# EAGLE design Genesis (EAGLE 9.6.2)
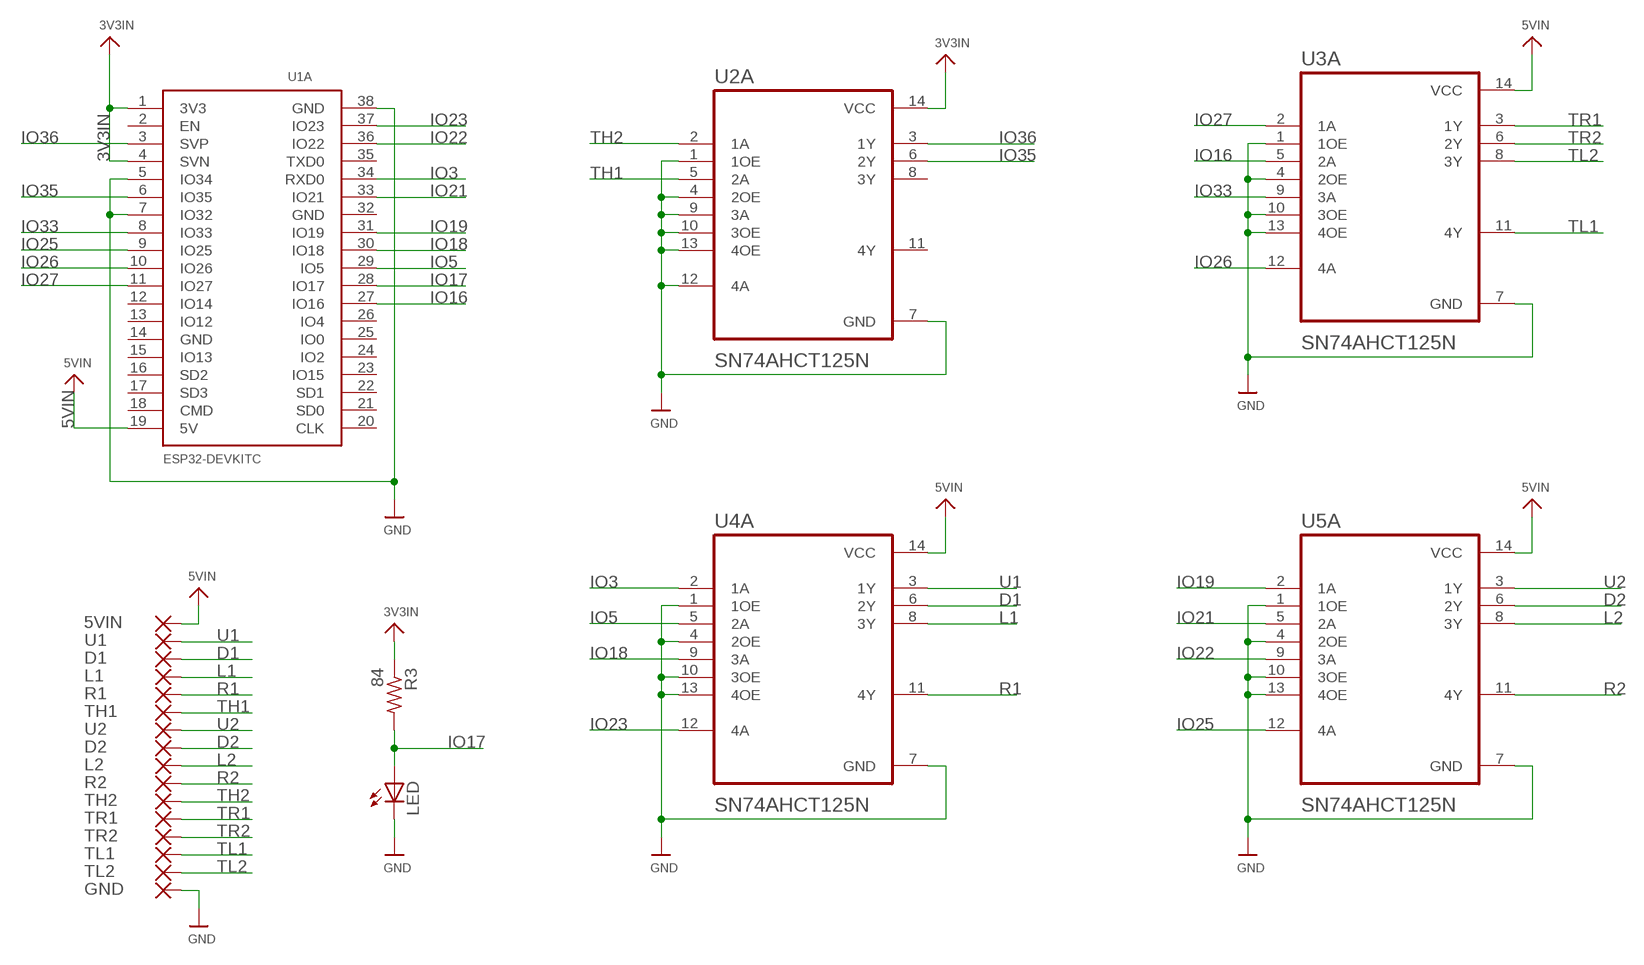
[diagram p0: schematic, sheet 1]

## Parts
5VIN  SMD5  [SMD2,54-5,08]
D1  SMD5  [SMD2,54-5,08]
D2  SMD5  [SMD2,54-5,08]
GND  SMD5  [SMD2,54-5,08]
L1  SMD5  [SMD2,54-5,08]
L2  SMD5  [SMD2,54-5,08]
LED  LEDCHIPLED_1206  [CHIPLED_1206]
R1  SMD5  [SMD2,54-5,08]
R2  SMD5  [SMD2,54-5,08]
R3  84  R-US_R1206  [R1206]
TH1  SMD5  [SMD2,54-5,08]
TH2  SMD5  [SMD2,54-5,08]
TL1  SMD5  [SMD2,54-5,08]
TL2  SMD5  [SMD2,54-5,08]
TR1  SMD5  [SMD2,54-5,08]
TR2  SMD5  [SMD2,54-5,08]
U1  SMD5  [SMD2,54-5,08]
U1A  ESP32DEVKITC  [ESP32-DEVKITC]
U2  SMD5  [SMD2,54-5,08]
U2A  SN74AHCT125N  [DIP794W45P254L1969H508Q14]
U3A  SN74AHCT125N  [DIP794W45P254L1969H508Q14]
U4A  SN74AHCT125N  [DIP794W45P254L1969H508Q14]
U5A  SN74AHCT125N  [DIP794W45P254L1969H508Q14]

## Nets
3V3IN: R3.1 U1A.1(3V3) U1A.4(SVN) U2A.14(VCC)
5VIN: 5VIN.1(P) U1A.19(5V) U3A.14(VCC) U4A.14(VCC) U5A.14(VCC)
D1: D1.1(P) U4A.6(2Y)
D2: D2.1(P) U5A.6(2Y)
GND: GND.1(P) LED.C U1A.5(IO34) U1A.7(IO32) U1A.38(GND) U2A.1(1OE) U2A.4(2OE) U2A.7(GND) U2A.9(3A) U2A.10(3OE) U2A.12(4A) U2A.13(4OE) U3A.1(1OE) U3A.4(2OE) U3A.7(GND) U3A.10(3OE) U3A.13(4OE) U4A.1(1OE) U4A.4(2OE) U4A.7(GND) U4A.10(3OE) U4A.13(4OE) U5A.1(1OE) U5A.4(2OE) U5A.7(GND) U5A.10(3OE) U5A.13(4OE)
IO3: U1A.34(RXD0) U4A.2(1A)
IO5: U1A.29(IO5) U4A.5(2A)
IO16: U1A.27(IO16) U3A.5(2A)
IO17: LED.A R3.2 U1A.28(IO17)
IO18: U1A.30(IO18) U4A.9(3A)
IO19: U1A.31(IO19) U5A.2(1A)
IO21: U1A.33(IO21) U5A.5(2A)
IO22: U1A.36(IO22) U5A.9(3A)
IO23: U1A.37(IO23) U4A.12(4A)
IO25: U1A.9(IO25) U5A.12(4A)
IO26: U1A.10(IO26) U3A.12(4A)
IO27: U1A.11(IO27) U3A.2(1A)
IO33: U1A.8(IO33) U3A.9(3A)
IO35: U1A.6(IO35) U2A.6(2Y)
IO36: U1A.3(SVP) U2A.3(1Y)
L1: L1.1(P) U4A.8(3Y)
L2: L2.1(P) U5A.8(3Y)
R1: R1.1(P) U4A.11(4Y)
R2: R2.1(P) U5A.11(4Y)
TH1: TH1.1(P) U2A.5(2A)
TH2: TH2.1(P) U2A.2(1A)
TL1: TL1.1(P) U3A.11(4Y)
TL2: TL2.1(P) U3A.8(3Y)
TR1: TR1.1(P) U3A.3(1Y)
TR2: TR2.1(P) U3A.6(2Y)
U1: U1.1(P) U4A.3(1Y)
U2: U2.1(P) U5A.3(1Y)
Unconnected: U1A.2(EN) U1A.12(IO14) U1A.13(IO12) U1A.14(GND) U1A.15(IO13) U1A.16(SD2) U1A.17(SD3) U1A.18(CMD) U1A.20(CLK) U1A.21(SD0) U1A.22(SD1) U1A.23(IO15) U1A.24(IO2) U1A.25(IO0) U1A.26(IO4) U1A.32(GND) U1A.35(TXD0) U2A.8(3Y) U2A.11(4Y)

## Library data of the parts
5VIN D1 D2 GND L1 L2 R1 R2 TH1 TH2 TL1 TL2 TR1 TR2 U1 U2 = wirepad:SMD5: SMD PAD
LED = adafruit:LED: LED OSRAM: - CHIPLED LG R971, LG N971, LY N971, LG Q971, LY Q971, LO R971, LY R971 LH N974, LH R974 LS Q976, LO Q976, LY Q976 LO Q996 - Hyper CHIPLED LW Q18S LB Q993, LB Q99A, LB R99A - SideLED LS A670, LO A670, LY A670, LG A670, LP A670 LB A673, LV A673, LT A673, LW A673 LH A674 LY A675 LS A676, LA A676, LO A676, LY A676, LW A676 LS A679, LY A679, LG A679 - Hyper Micro SIDELED® LS Y876, LA Y876, LO Y876, LY Y876 LT Y87S - SmartLED LW L88C, LW L88S LB L89C, LB L89S, LG L890 LS L89K, LO L89K, LY L89K LS L896, LA L896, LO L896, LY L896 - TOPLED LS T670, LO T670, LY T670, LG T670, LP T670 LSG T670, LSP T670, LSY T670, LOP T670, LYG T670 LG T671, LOG T671, LSG T671 LB T673, LV T673, LT T673, LW T673 LH T674 LS T676, LA T676, LO T676, LY T676, LB T676, LH T676, LSB T676, LW T676 LB T67C, LV T67C, LT T67C, LS T67K, LO T67K, LY T67K, LW E67C LS E67B, LA E67B, LO E67B, LY E67B, LB E67C, LV E67C, LT E67C LW T67C LS T679, LY T679, LG T679 LS T770, LO T770, LY T770, LG T770, LP T770 LB T773, LV T773, LT T773, LW T773 LH T774 LS E675, LA E675, LY E675, LS T675 LS T776, LA T776, LO T776, LY T776, LB T776 LHGB T686 LT T68C, LB T68C - Hyper Mini TOPLED® LB M676 - Mini TOPLED Santana® LG M470 LS M47K, LO M47K, LY M47K Source: http://www.osram.convergy.de/
R3 = adafruit:R-US_: RESISTOR, American symbol
U1A = ESP32-DEVKITC:ESP32DEVKITC
U2A U3A U4A U5A = SN74AHCT125N:SN74AHCT125N: None Check prices <https://pricing.snapeda.com/parts/SN74AHCT125N/Texas%20Instruments/view-part?ref=eda>; AVAILABILITY: In Stock; DESCRIPTION: Quadruple Bus Buffer Gates With 3-State Outputs 14-PDIP -40 to 125; MF: Texas Instruments; MP: SN74AHCT125N; PACKAGE: PDIP-14 Texas Instruments; PRICE: None; PURCHASE-URL: https://pricing.snapeda.com/search/part/SN74AHCT125N/?ref=eda

## Board
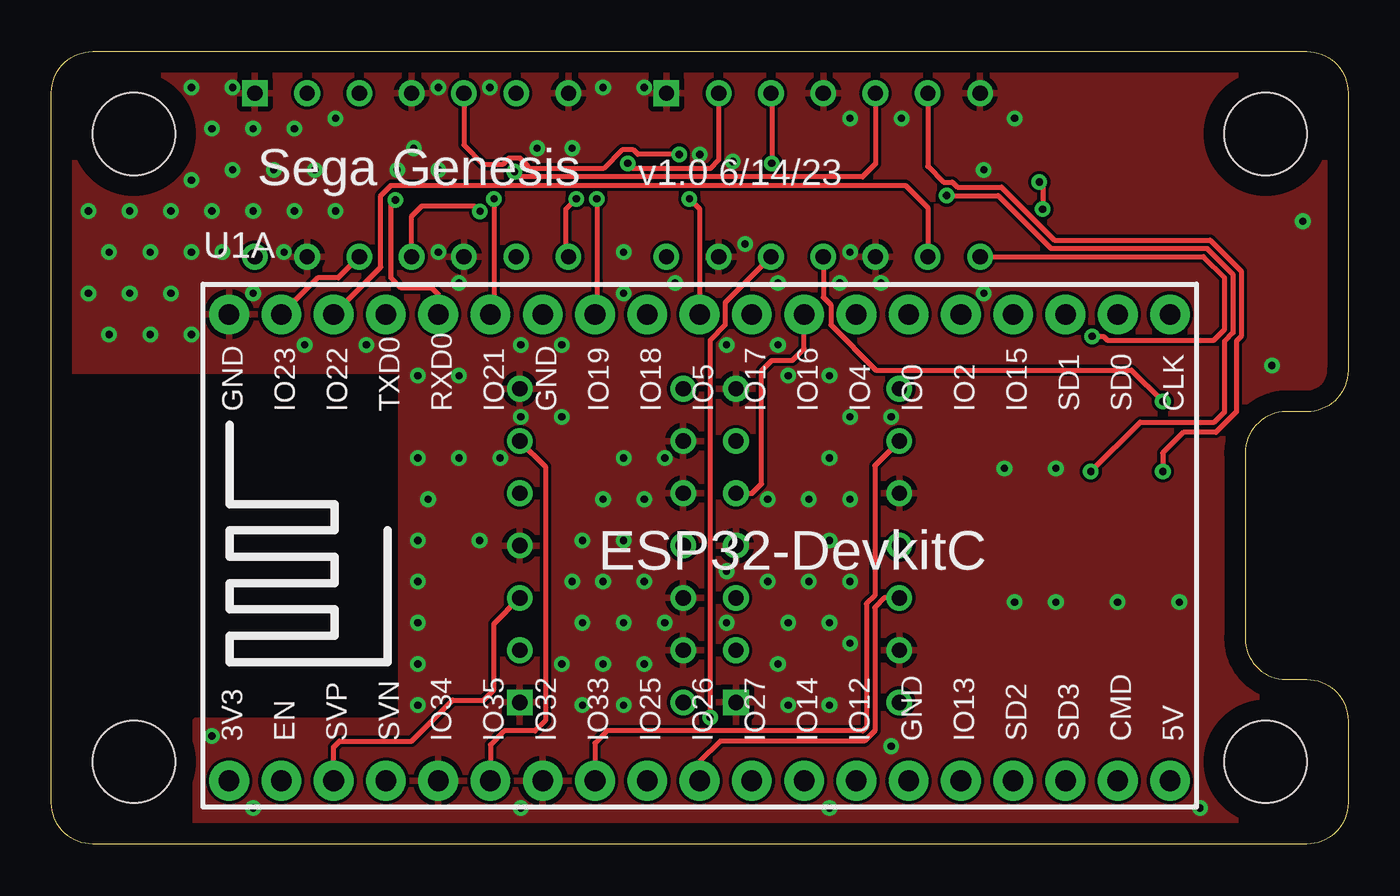
[diagram p1: board, top side]
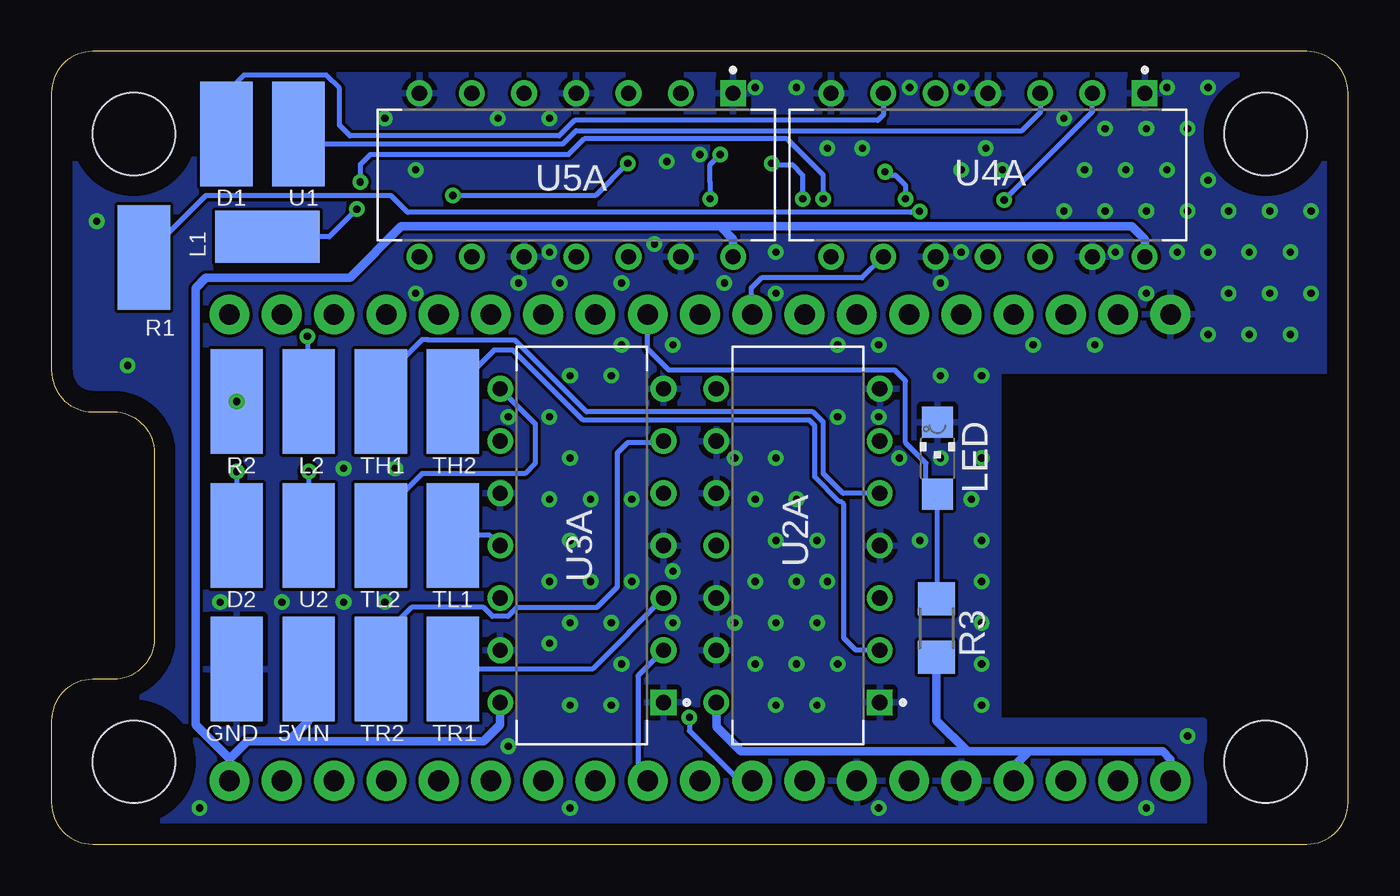
[diagram p2: board, bottom side, seen from below]

Size 63 x 38.5 mm. Coordinates in mm from the lower left corner, seen from the top.
Outline: 0,2 0,36.5 arc-90 2,38.5 61,38.5 arc-90 63,36.5 63,23 arc-90 61,21 60,21 arc90 58,19 58,10 arc90 60,8 61,8 arc-90 63,6 63,2 arc-90 61,0 2,0 arc-90 0,2
Copper layers (1*16): Top 0.035mm / dielectric 1.5mm / Bottom 0.035mm
Design rules "default": minimum track width 6mil, minimum drill 0.35mm, track to track 6mil, track to pad 6mil, pad to pad 6mil, via to via 6mil, smd to smd 6mil, copper to edge 40mil, drill to drill 6mil, minimum pad ring 10mil, minimum via ring 8mil, stop-mask expansion 4mil, vias tented up to drill 0.5mm, thermal gap 10mil
Holes 4 mm at 4,4 4,34.5 59,34.5 59,4

### Footprints (pad centres in the part's own frame; a part is rotated, then mirrored left to right if it is on the bottom)
SMD2,54-5,08 = smd 2.54 x 5.08: 1 0,0
CHIPLED_1206 = smd 1.5 x 1.5: A 0,-1.75; C 0,1.75
R1206 = smd 1.6 x 1.803: 1 -1.422,0; 2 1.422,0
ESP32-DEVKITC = drill 1 pad 1.93: 1 -22.87,-11.42; 2 -20.33,-11.42; 3 -17.79,-11.42; 4 -15.25,-11.42; 5 -12.71,-11.42; 6 -10.17,-11.42; 7 -7.63,-11.42; 8 -5.09,-11.42; 9 -2.55,-11.42; 10 -0.01,-11.42; 11 2.53,-11.42; 12 5.07,-11.42; 13 7.61,-11.42; 14 10.15,-11.42; 15 12.69,-11.42; 16 15.23,-11.42; 17 17.77,-11.42; 18 20.31,-11.42; 19 22.85,-11.42; 20 22.85,11.23; 21 20.31,11.23; 22 17.77,11.23; 23 15.23,11.23; 24 12.69,11.23; 25 10.15,11.23; 26 7.61,11.23; 27 5.07,11.23; 28 2.53,11.23; 29 -0.01,11.23; 30 -2.55,11.23; 31 -5.09,11.23; 32 -7.63,11.23; 33 -10.17,11.23; 34 -12.71,11.23; 35 -15.25,11.23; 36 -17.79,11.23; 37 -20.33,11.23; 38 -22.87,11.23
DIP794W45P254L1969H508Q14 = drill 0.74 pad 1.14 square: 1 -3.97,7.62 | drill 0.74 pad 1.14: 2 -3.97,5.08; 3 -3.97,2.54; 4 -3.97,0; 5 -3.97,-2.54; 6 -3.97,-5.08; 7 -3.97,-7.62; 8 3.97,-7.62; 9 3.97,-5.08; 10 3.97,-2.54; 11 3.97,0; 12 3.97,2.54; 13 3.97,5.08; 14 3.97,7.62

### Placement (x,y rotation side)
5VIN  50.5,8.5 180 bottom
D1  54.5,34.5 0 bottom
D2  54,15 0 bottom
GND  54,8.5 180 bottom
L1  52.5,29.5 270 bottom
L2  50.5,21.5 0 bottom
LED  19.95,18.74 0 bottom
R1  58.5,28.5 0 bottom
R2  54,21.5 0 bottom
R3  20,10.5 90 bottom
TH1  47,21.5 180 bottom
TH2  43.5,21.5 0 bottom
TL1  43.5,15 0 bottom
TL2  47,15 0 bottom
TR1  43.5,8.5 0 bottom
TR2  47,8.5 0 bottom
U1  51,34.5 180 bottom
U1A  31.5,14.5 0 top
U2  50.5,15 180 bottom
U2A  26.73,14.5 180 bottom
U3A  37.23,14.5 180 bottom
U4A  17.5,32.5 270 bottom
U5A  37.5,32.5 270 bottom

### Tracks (layer width: path | path; a pad name or v marks a point on that pad's centre or on a via)
3V3IN
  Bottom 0.406: U1A.1 8.63,4.13 9,4.5 15.5,4.5 | 15.5,4.5 18.5,4.5 | 18.5,4.5 29.5,4.5 30.7,5.7 U2A.14 | U1A.4 16.25,3.75 15.5,4.5 | 18.5,4.5 20,6 R3.1
5VIN
  Bottom 0.406: U3A.14 41.2,5.8 42,5 51.5,5 | 51.5,5 53.5,5 54.35,4.15 | 54.35,4.15 U1A.19 | U4A.14 9.88,29.38 10.5,30 30.5,30 | 54.35,4.15 56,5.8 56,27 55.5,27.5 48.5,27.5 46,30 30.5,30 | U5A.14 29.88,29.38 30.5,30 | 51.5,5 50.5,6 5VIN.1
D1
  Bottom 0.254: U4A.6 22.58,35.42 22.84,35.16 37.58,35.16 38.33,34.41 48.5,34.41 49,34.91 49,36.7 49.65,37.36 53.64,37.36 54.5,36.5 D1.1
D2  (via drill 0.35)
  Top 0.254: U5A.6 42.58,32.92 43.34,32.16 43.77,32.16 44.02,31.91 46.17,31.91 48.73,29.34 56.31,29.34 57.81,27.84 57.81,24.66 57.58,24.43 57.58,21 56.58,20 55,20 54,19 v54,18.1
  Bottom 0.254: v54,18.1 D2.1
GND  (via drill 0.35)
  other vias: 2.8,24.75 1.8,26.75 2.8,28.75 1.8,30.75 4.8,24.75 3.8,26.75 4.8,28.75 3.8,30.75 6.8,24.75 5.8,26.75 6.8,28.75 5.8,30.75 6.8,32.25 6.8,36.75 7.8,5.25 8.3,28.75 7.8,30.75 8.8,32.75 7.8,34.75 8.8,36.75 9.8,1.75 9.8,26.75 11.3,28.75 9.8,30.75 10.8,32.75 9.8,34.75 20.8,14.75 12.3,24.25 11.8,30.75 12.8,32.75 11.8,34.75 15.3,24.25 13.8,30.75 13.8,35.25 17.8,12.75 16.8,32.75 17.8,6.75 17.8,10.75 17.8,14.75 18.3,16.75 17.8,18.75 17.8,22.75 18.8,28.75 18.8,32.75 18.8,36.75 17.8,8.75 19.8,18.75 19.8,22.75 19.8,27.25 21.3,36.75 21.8,18.75 22.8,20.75 22.8,24.25 22.8,1.75 24.8,8.75 25.3,12.75 24.8,20.75 24.8,24.25 25.8,6.75 26.8,8.75 25.8,10.75 26.8,12.75 25.8,14.75 26.8,16.75 26.8,36.75 27.8,6.75 28.8,8.75 27.8,10.75 28.8,12.75 27.8,14.75 28.8,16.75 27.8,18.75 27.8,26.75 27.8,28.75 28.8,36.75 29.8,10.75 29.8,18.75 30.3,27.25 33.7,29.15 32.8,13.25 32.8,24.25 33.1,33.15 35.3,8.75 32.8,10.75 34.8,12.75 34.8,16.75 35.3,24.25 35.8,6.75 35.8,10.75 36.8,12.75 36.8,16.75 35.8,22.75 35.3,27.25 41.3,35.25 37.8,1.75 37.8,6.75 37.8,10.75 38.8,12.75 37.8,14.75 38.8,16.75 37.8,18.75 38.8,20.75 37.8,22.75 38.3,27.25 38.8,28.75 38.8,35.25 40.8,4.75 40.8,20.75 40.3,27.25 45.3,32.75 38.8,9.75 59.3,23.25 45.3,26.75 46.8,35.25 48.8,11.75 46.8,11.75 46.3,18.25 48.8,18.25 60.8,30.25 54.8,11.75 51.8,11.75 55.8,1.75 31.5,33.5 23.6,33.8 25.3,33.8 17.6,33.8
  pour Bottom: 7,0 63,0 63,38.5 0,38.5 0,23 17,23 17,6 7,6
  pour Top: 0,38.5 0,23 17,23 17,6 7,6 7,0 63,0 63,38.5
IO3  (via drill 0.35)
  Top 0.254: U1A.34 18.79,26.71 18.5,27 17,27 16.5,27.5 16.5,31.07 v16.71,31.29
  Bottom 0.254: v16.71,31.29 12.42,35.58 U4A.2
IO5  (via drill 0.35)
  Top 0.254: v31,31.34 31.49,30.85 U1A.29 | U4A.5 20.04,33.96 21,33 21.91,33 22.23,33.31 22.77,33.31 23.16,32.93 23.16,32.81 26.82,32.81 27.73,33.72 28.27,33.72 28.49,33.5 v30.5,33.5
  Bottom 0.254: v31,31.34 31,32 31,32.16 31,33 v30.5,33.5
IO16
  Top 0.254: U3A.5 34.04,17.04 34.5,17.5 34.5,23 35,23.5 36,23.5 36.57,24.07 U1A.27
IO17
  Bottom 0.254: R3.2 19.95,11.97 LED.A 20.5,17.54 20.5,18.5 21.5,19.5 21.5,22.5 22.02,23.02 33,23.02 34.03,24.05 U1A.28
IO18
  Bottom 0.254: U4A.9 23.61,27.5 28.5,27.5 29,27 29,25.78 U1A.30
IO19  (via drill 0.35)
  Top 0.254: U5A.2 32.42,33.23 32,32.81 28.25,32.81 v28,33.06 | v26.5,31.34 26.5,25.82 U1A.31
  Bottom 0.254: v28,33.06 27.94,33 27,33 26.5,32.5 v26.5,31.34
IO21  (via drill 0.35)
  Top 0.254: U5A.5 40.04,33.04 39.41,32.41 22.75,32.41 v22.5,32.66 | v21.5,31.34 21.5,25.9 U1A.33
  Bottom 0.254: v22.5,32.66 22.34,32.5 22,32.5 21.5,32 v21.5,31.34
IO22
  Top 0.254: U1A.36 16,28.02 16,31.5 16.5,32 41.5,32 42.58,30.92 U5A.9
IO23
  Top 0.254: U4A.12 13.93,27.5 12.94,27.5 U1A.37
IO25  (via drill 0.35)
  Top 0.254: U5A.12 32.73,26.3 32.73,25.21 32,24.48 v32,6.16
  Bottom 0.254: v32,6.16 32,5.5 29.58,3.08 U1A.9
IO26
  Top 0.254: U3A.12 40.46,11.96 40,11.5 40,5.5 39.5,5 32.5,5 31.49,3.99 U1A.10
IO27
  Bottom 0.254: U3A.2 34.5,8.18 34.5,3.55 U1A.11
IO33
  Top 0.254: U3A.9 40,18.38 40,12.07 39.59,11.67 39.59,5.67 39.42,5.5 27,5.5 26.41,4.91 U1A.8
IO35
  Top 0.254: U2A.6 24,18.34 24,6 23.5,5.5 22,5.5 21.33,4.83 U1A.6
IO36
  Top 0.254: U1A.3 13.71,4.71 14,5 17.5,5 19.5,7 21,7 21.5,7.5 21.5,10.7 U2A.3
L1  (via drill 0.35)
  Top 0.254: U4A.8 25,28.65 25,30.84 v25.5,31.34 | v48,32.16 48.16,32 v48.16,30.84
  Bottom 0.254: v25.5,31.34 25.5,32.5 27.25,34.25 37.12,34.25 37.87,33.5 47.5,33.5 48,33 v48,32.16 | v48.16,30.84 49.51,29.5 L1.1
L2  (via drill 0.35)
  Top 0.254: U5A.8 55.97,28.53 57,27.5 57,25 56.48,24.48 51.29,24.48 51.12,24.66 v50.56,24.66
  Bottom 0.254: v50.56,24.66 50.56,21.56 L2.1
R1  (via drill 0.35)
  Top 0.254: U4A.11 17.5,30.5 18,31 20.56,31 v20.82,30.73
  Bottom 0.254: v20.82,30.73 21.18,30.73 21.23,30.68 45.69,30.68 46,31 46.5,31.5 55.5,31.5 R1.1
R2  (via drill 0.35)
  Top 0.254: U5A.11 37.5,26.56 37.87,26.2 37.87,25.21 40.06,23.02 52.48,23.02 R2.1
  other vias: 54,21.5
TH1
  Bottom 0.254: U2A.5 24.54,17.04 25.5,18 25.5,20.5 26,21 37,21 40.48,24.48 44.71,24.48 44.72,24.5 45,24.5 47,22.5 TH1.1
TH2
  Bottom 0.254: U2A.2 23.92,9.42 24.5,10 24.5,16.5 24.63,16.63 24.71,16.63 25.91,17.83 25.91,20.33 26.17,20.59 37.17,20.59 40.58,24 41.5,24 43.5,22 TH2.1
TL1
  Bottom 0.254: U3A.11 41.7,15 TL1.1
TL2
  Bottom 0.254: U3A.8 39.5,20.42 39.5,18.5 40,18 45,18 47,16 TL2.1
TR1
  Bottom 0.254: U3A.3 36.72,8.5 TR1.1
TR2
  Bottom 0.254: U3A.6 33.34,19.5 35,19.5 35.5,19 35.5,12.5 36.5,11.5 40.38,11.5 40.82,11.06 41.57,11.06 42.02,11.5 45.5,11.5 47,10 TR2.1
U1
  Bottom 0.254: U4A.3 14.96,35.54 15.84,34.66 37.5,34.66 38.16,34 50.5,34 U1.1
U2  (via drill 0.35)
  Top 0.254: v43.5,31.5 46,31.5 48.56,28.94 56.14,28.94 57.41,27.67 57.41,24.83 57,24.43 57,21 56.5,20.5 52.9,20.5 v50.5,18.1 | U5A.3 35,36.43 v35,33.06
  Bottom 0.254: v50.5,18.1 U2.1 | v35,33.06 36.56,31.5 v43.5,31.5

### Text on the board
tPlace: Sega Genesis | v1.0 6/14/23